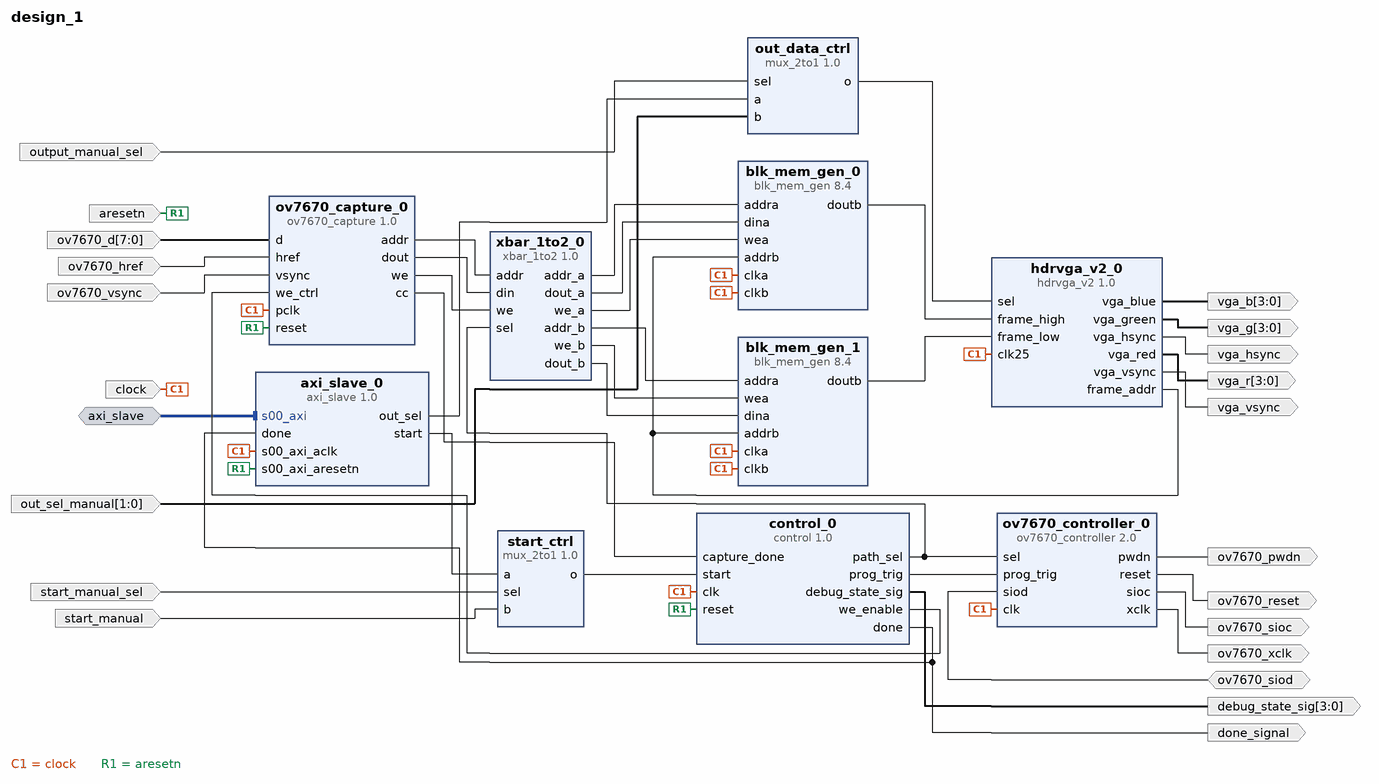
[diagram p0: block diagram of the top level]
# Vivado block design design_1, xc7a100tcsg324-1, Vivado 2018.1
create_bd_design design_1

create_bd_intf_port -mode Slave -vlnv xilinx.com:interface:aximm_rtl:1.0 axi_slave
set_property -dict [list \
  CONFIG.DATA_WIDTH 32 \
  CONFIG.PROTOCOL AXI4LITE \
  CONFIG.ID_WIDTH 0 \
  CONFIG.ADDR_WIDTH 16 \
  CONFIG.AWUSER_WIDTH 0 \
  CONFIG.ARUSER_WIDTH 0 \
  CONFIG.WUSER_WIDTH 0 \
  CONFIG.RUSER_WIDTH 0 \
  CONFIG.BUSER_WIDTH 0 \
  CONFIG.READ_WRITE_MODE READ_WRITE \
  CONFIG.HAS_BURST 0 \
  CONFIG.HAS_LOCK 0 \
  CONFIG.HAS_PROT 1 \
  CONFIG.HAS_CACHE 0 \
  CONFIG.HAS_QOS 0 \
  CONFIG.HAS_REGION 0 \
  CONFIG.HAS_WSTRB 1 \
  CONFIG.HAS_BRESP 1 \
  CONFIG.HAS_RRESP 1 \
  CONFIG.SUPPORTS_NARROW_BURST 0 \
  CONFIG.NUM_READ_OUTSTANDING 1 \
  CONFIG.NUM_WRITE_OUTSTANDING 1 \
  CONFIG.MAX_BURST_LENGTH 1 \
  CONFIG.NUM_READ_THREADS 1 \
  CONFIG.NUM_WRITE_THREADS 1 \
  CONFIG.RUSER_BITS_PER_BYTE 0 \
  CONFIG.WUSER_BITS_PER_BYTE 0 \
] [get_bd_intf_ports axi_slave]
create_bd_port -dir I -type clk clock
set_property -dict {CONFIG.FREQ_HZ 100000000 CONFIG.PHASE 0.000} [get_bd_ports clock]
create_bd_port -dir I -from 7 -to 0 ov7670_d
create_bd_port -dir I ov7670_href
create_bd_port -dir I ov7670_vsync
create_bd_port -dir O -from 3 -to 0 debug_state_sig
create_bd_port -dir O done_signal
create_bd_port -dir O ov7670_sioc
create_bd_port -dir IO ov7670_siod
create_bd_port -dir O -type rst ov7670_reset
create_bd_port -dir O ov7670_pwdn
create_bd_port -dir O -type clk ov7670_xclk
create_bd_port -dir I -type rst aresetn
create_bd_port -dir I output_manual_sel
create_bd_port -dir I -from 1 -to 0 out_sel_manual
create_bd_port -dir I start_manual_sel
create_bd_port -dir O -from 3 -to 0 vga_r
create_bd_port -dir O -from 3 -to 0 vga_g
create_bd_port -dir O -from 3 -to 0 vga_b
create_bd_port -dir O vga_hsync
create_bd_port -dir O vga_vsync
create_bd_port -dir I start_manual

create_bd_cell -type ip -vlnv xilinx.com:ip:blk_mem_gen:8.4 blk_mem_gen_0
set_property -dict [list \
  CONFIG.Memory_Type Simple_Dual_Port_RAM \
  CONFIG.Enable_32bit_Address false \
  CONFIG.Use_Byte_Write_Enable false \
  CONFIG.Write_Width_A 12 \
  CONFIG.Write_Depth_A 153600 \
  CONFIG.Operating_Mode_A NO_CHANGE \
  CONFIG.Enable_A Always_Enabled \
  CONFIG.Write_Width_B 12 \
  CONFIG.Read_Width_B 12 \
  CONFIG.Enable_B Always_Enabled \
  CONFIG.Register_PortB_Output_of_Memory_Primitives true \
  CONFIG.Use_RSTB_Pin false \
  CONFIG.Port_A_Write_Rate 50 \
  CONFIG.Port_B_Clock 100 \
  CONFIG.Port_B_Enable_Rate 100 \
  CONFIG.use_bram_block Stand_Alone \
] [get_bd_cells blk_mem_gen_0]
create_bd_cell -type ip -vlnv xilinx.com:ip:blk_mem_gen:8.4 blk_mem_gen_1
set_property -dict [list \
  CONFIG.Memory_Type Simple_Dual_Port_RAM \
  CONFIG.Enable_32bit_Address false \
  CONFIG.Use_Byte_Write_Enable false \
  CONFIG.Write_Width_A 12 \
  CONFIG.Write_Depth_A 153600 \
  CONFIG.Operating_Mode_A NO_CHANGE \
  CONFIG.Enable_A Always_Enabled \
  CONFIG.Write_Width_B 12 \
  CONFIG.Read_Width_B 12 \
  CONFIG.Enable_B Always_Enabled \
  CONFIG.Register_PortB_Output_of_Memory_Primitives true \
  CONFIG.Use_RSTB_Pin false \
  CONFIG.Port_A_Write_Rate 50 \
  CONFIG.Port_B_Clock 100 \
  CONFIG.Port_B_Enable_Rate 100 \
  CONFIG.use_bram_block Stand_Alone \
] [get_bd_cells blk_mem_gen_1]
create_bd_cell -type ip -vlnv xilinx.com:user:xbar_1to2:1.0 xbar_1to2_0
create_bd_cell -type ip -vlnv xilinx.com:user:control:1.0 control_0
create_bd_cell -type ip -vlnv xilinx.com:user:ov7670_capture:1.0 ov7670_capture_0
create_bd_cell -type ip -vlnv xilinx.com:user:ov7670_controller:2.0 ov7670_controller_0
create_bd_cell -type ip -vlnv xilinx.com:user:mux_2to1:1.0 out_data_ctrl
set_property -dict {CONFIG.DATA_WIDTH 2} [get_bd_cells out_data_ctrl]
create_bd_cell -type ip -vlnv xilinx.com:user:mux_2to1:1.0 start_ctrl
set_property -dict {CONFIG.DATA_WIDTH 1} [get_bd_cells start_ctrl]
create_bd_cell -type ip -vlnv xilinx.com:user:axi_slave:1.0 axi_slave_0
create_bd_cell -type ip -vlnv xilinx.com:user:hdrvga_v2:1.0 hdrvga_v2_0

# ---- connections ----

connect_bd_intf_net [get_bd_intf_ports axi_slave] [get_bd_intf_pins axi_slave_0/s00_axi]
connect_bd_net -net clk_wiz_0_clk_25 [get_bd_ports clock] \
  [get_bd_pins blk_mem_gen_0/clkb] [get_bd_pins blk_mem_gen_1/clka] [get_bd_pins blk_mem_gen_1/clkb] \
  [get_bd_pins blk_mem_gen_0/clka] [get_bd_pins control_0/clk] [get_bd_pins ov7670_capture_0/pclk] \
  [get_bd_pins ov7670_controller_0/clk] [get_bd_pins axi_slave_0/s00_axi_aclk] [get_bd_pins hdrvga_v2_0/clk25]
connect_bd_net [get_bd_pins ov7670_capture_0/addr] [get_bd_pins xbar_1to2_0/addr]
connect_bd_net [get_bd_pins ov7670_capture_0/dout] [get_bd_pins xbar_1to2_0/din]
connect_bd_net -net d_0_1 [get_bd_ports ov7670_d] [get_bd_pins ov7670_capture_0/d]
connect_bd_net -net href_0_1 [get_bd_ports ov7670_href] [get_bd_pins ov7670_capture_0/href]
connect_bd_net -net vsync_0_1 [get_bd_ports ov7670_vsync] [get_bd_pins ov7670_capture_0/vsync]
connect_bd_net [get_bd_pins control_0/debug_state_sig] [get_bd_ports debug_state_sig]
connect_bd_net -net control_0_prog [get_bd_pins control_0/prog_trig] [get_bd_pins ov7670_controller_0/prog_trig]
connect_bd_net [get_bd_pins xbar_1to2_0/addr_b] [get_bd_pins blk_mem_gen_1/addra]
connect_bd_net [get_bd_pins xbar_1to2_0/we_b] [get_bd_pins blk_mem_gen_1/wea]
connect_bd_net [get_bd_pins xbar_1to2_0/dout_b] [get_bd_pins blk_mem_gen_1/dina]
connect_bd_net [get_bd_pins xbar_1to2_0/addr_a] [get_bd_pins blk_mem_gen_0/addra]
connect_bd_net [get_bd_pins xbar_1to2_0/dout_a] [get_bd_pins blk_mem_gen_0/dina]
connect_bd_net [get_bd_pins xbar_1to2_0/we_a] [get_bd_pins blk_mem_gen_0/wea]
connect_bd_net [get_bd_pins ov7670_capture_0/we] [get_bd_pins xbar_1to2_0/we]
connect_bd_net [get_bd_pins control_0/path_sel] [get_bd_pins xbar_1to2_0/sel] [get_bd_pins ov7670_controller_0/sel]
connect_bd_net [get_bd_pins control_0/done] [get_bd_ports done_signal] [get_bd_pins axi_slave_0/done]
connect_bd_net [get_bd_pins ov7670_capture_0/cc] [get_bd_pins control_0/capture_done]
connect_bd_net [get_bd_pins control_0/we_enable] [get_bd_pins ov7670_capture_0/we_ctrl]
connect_bd_net [get_bd_pins ov7670_controller_0/sioc] [get_bd_ports ov7670_sioc]
connect_bd_net [get_bd_ports ov7670_siod] [get_bd_pins ov7670_controller_0/siod]
connect_bd_net [get_bd_pins ov7670_controller_0/reset] [get_bd_ports ov7670_reset]
connect_bd_net [get_bd_pins ov7670_controller_0/pwdn] [get_bd_ports ov7670_pwdn]
connect_bd_net [get_bd_pins ov7670_controller_0/xclk] [get_bd_ports ov7670_xclk]
connect_bd_net -net s00_axi_aresetn_0_1 [get_bd_ports aresetn] \
  [get_bd_pins ov7670_capture_0/reset] [get_bd_pins control_0/reset] [get_bd_pins axi_slave_0/s00_axi_aresetn]
connect_bd_net [get_bd_ports output_manual_sel] [get_bd_pins out_data_ctrl/sel]
connect_bd_net [get_bd_ports out_sel_manual] [get_bd_pins out_data_ctrl/b]
connect_bd_net [get_bd_ports start_manual_sel] [get_bd_pins start_ctrl/sel]
connect_bd_net -net mux_2to1_1_o [get_bd_pins start_ctrl/o] [get_bd_pins control_0/start]
connect_bd_net [get_bd_ports start_manual] [get_bd_pins start_ctrl/b]
connect_bd_net [get_bd_pins axi_slave_0/out_sel] [get_bd_pins out_data_ctrl/a]
connect_bd_net [get_bd_pins axi_slave_0/start] [get_bd_pins start_ctrl/a]
connect_bd_net [get_bd_pins hdrvga_v2_0/frame_addr] [get_bd_pins blk_mem_gen_0/addrb] [get_bd_pins blk_mem_gen_1/addrb]
connect_bd_net [get_bd_pins out_data_ctrl/o] [get_bd_pins hdrvga_v2_0/sel]
connect_bd_net [get_bd_pins hdrvga_v2_0/vga_red] [get_bd_ports vga_r]
connect_bd_net [get_bd_pins hdrvga_v2_0/vga_green] [get_bd_ports vga_g]
connect_bd_net [get_bd_pins hdrvga_v2_0/vga_blue] [get_bd_ports vga_b]
connect_bd_net [get_bd_pins hdrvga_v2_0/vga_hsync] [get_bd_ports vga_hsync]
connect_bd_net [get_bd_pins hdrvga_v2_0/vga_vsync] [get_bd_ports vga_vsync]
connect_bd_net [get_bd_pins blk_mem_gen_1/doutb] [get_bd_pins hdrvga_v2_0/frame_low]
connect_bd_net [get_bd_pins blk_mem_gen_0/doutb] [get_bd_pins hdrvga_v2_0/frame_high]

# ---- address map ----
assign_bd_address -offset 0x0000 -range 4K -target_address_space [get_bd_addr_spaces axi_slave] [get_bd_addr_segs axi_slave_0/s00_axi/reg0]

validate_bd_design
save_bd_design
